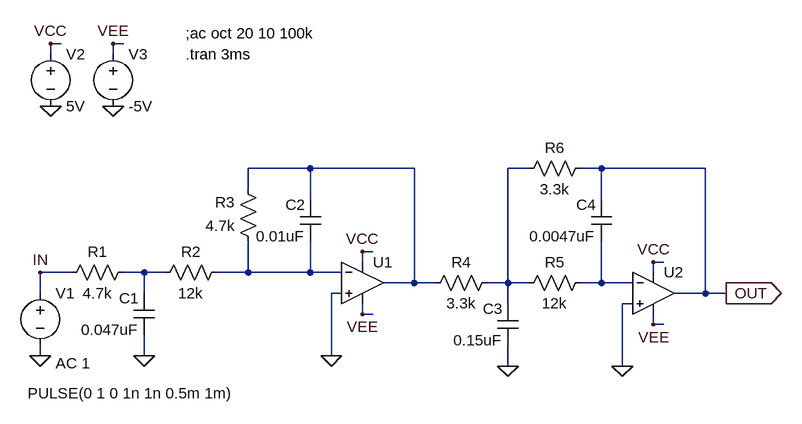
[diagram p0: schematic 4thButterWorthLPF_MFB_fail.asc]
4thButterWorthLPF_MFB_fail.asc, the LTspice schematic file:
Version 4
SHEET 1 964 680
WIRE -336 -176 -352 -176
WIRE -240 -176 -256 -176
WIRE -352 -160 -352 -176
WIRE -256 -160 -256 -176
WIRE 48 16 -48 16
WIRE 208 16 48 16
WIRE 384 16 352 16
WIRE 496 16 464 16
WIRE 656 16 496 16
WIRE -48 48 -48 16
WIRE 48 64 48 16
WIRE 496 64 496 16
WIRE 144 144 128 144
WIRE 128 160 128 144
WIRE 592 160 576 160
WIRE -320 176 -368 176
WIRE -208 176 -240 176
WIRE -176 176 -208 176
WIRE -48 176 -48 128
WIRE -48 176 -96 176
WIRE 48 176 48 128
WIRE 48 176 -48 176
WIRE 96 176 48 176
WIRE 576 176 576 160
WIRE 208 192 208 16
WIRE 208 192 160 192
WIRE 240 192 208 192
WIRE 352 192 352 16
WIRE 352 192 320 192
WIRE 384 192 352 192
WIRE 496 192 496 128
WIRE 496 192 464 192
WIRE 544 192 496 192
WIRE -368 208 -368 176
WIRE -208 208 -208 176
WIRE 96 208 80 208
WIRE 656 208 656 16
WIRE 656 208 608 208
WIRE 688 208 656 208
WIRE 352 224 352 192
WIRE 544 224 528 224
WIRE 128 240 128 224
WIRE 144 240 128 240
WIRE 576 256 576 240
WIRE 592 256 576 256
WIRE -368 304 -368 288
WIRE -208 304 -208 272
WIRE 80 304 80 208
WIRE 352 320 352 288
WIRE 528 320 528 224
FLAG 128 144 VCC
FLAG 128 240 VEE
FLAG -368 304 0
FLAG -352 -80 0
FLAG -256 -80 0
FLAG -352 -176 VCC
FLAG -256 -176 VEE
FLAG 688 208 OUT
IOPIN 688 208 Out
FLAG -208 304 0
FLAG 80 304 0
FLAG 576 160 VCC
FLAG 576 256 VEE
FLAG 352 320 0
FLAG 528 320 0
FLAG -368 176 IN
SYMBOL Opamps\\UniversalOpamp2 128 192 R0
SYMATTR InstName U1
SYMBOL res -224 160 R90
WINDOW 0 0 56 VBottom 2
WINDOW 3 32 56 VTop 2
SYMATTR InstName R1
SYMATTR Value 4.7k
SYMBOL res -80 160 R90
WINDOW 0 0 56 VBottom 2
WINDOW 3 32 56 VTop 2
SYMATTR InstName R2
SYMATTR Value 12k
SYMBOL cap -192 272 R180
WINDOW 0 24 56 Left 2
WINDOW 3 24 8 Left 2
SYMATTR InstName C1
SYMATTR Value 0.047uF
SYMBOL voltage -368 192 R0
WINDOW 123 24 124 Left 2
WINDOW 39 0 0 Left 2
WINDOW 3 -19 170 Left 2
SYMATTR Value2 AC 1
SYMATTR Value PULSE(0 1 0 1n 1n 0.5m 1m)
SYMATTR InstName V1
SYMBOL voltage -352 -176 R0
WINDOW 123 0 0 Left 2
WINDOW 39 0 0 Left 2
SYMATTR InstName V2
SYMATTR Value 5V
SYMBOL voltage -256 -176 R0
WINDOW 123 0 0 Left 2
WINDOW 39 0 0 Left 2
SYMATTR InstName V3
SYMATTR Value -5V
SYMBOL cap 64 128 R180
WINDOW 0 24 56 Left 2
WINDOW 3 24 8 Left 2
SYMATTR InstName C2
SYMATTR Value 0.01uF
SYMBOL res -32 144 R180
WINDOW 0 36 76 Left 2
WINDOW 3 36 40 Left 2
SYMATTR InstName R3
SYMATTR Value 4.7k
SYMBOL Opamps\\UniversalOpamp2 576 208 R0
SYMATTR InstName U2
SYMBOL res 336 176 R90
WINDOW 0 0 56 VBottom 2
WINDOW 3 32 56 VTop 2
SYMATTR InstName R4
SYMATTR Value 3.3k
SYMBOL res 480 176 R90
WINDOW 0 0 56 VBottom 2
WINDOW 3 32 56 VTop 2
SYMATTR InstName R5
SYMATTR Value 12k
SYMBOL cap 368 288 R180
WINDOW 0 24 56 Left 2
WINDOW 3 24 8 Left 2
SYMATTR InstName C3
SYMATTR Value 0.15uF
SYMBOL cap 512 128 R180
WINDOW 0 24 56 Left 2
WINDOW 3 24 8 Left 2
SYMATTR InstName C4
SYMATTR Value 0.0047uF
SYMBOL res 480 0 R90
WINDOW 0 0 56 VBottom 2
WINDOW 3 32 56 VTop 2
SYMATTR InstName R6
SYMATTR Value 3.3k
TEXT -144 -192 Left 2 !;ac oct 20 10 100k
TEXT -144 -160 Left 2 !.tran 3ms

The netlist it stands for:
* 4thButterWorthLPF_MFB_fail.asc
XU1 0 N004 VCC VEE N001 level.2 Avol=1Meg GBW=10Meg Slew=10Meg ilimit=25m rail=0 Vos=0 phimargin=45 en=0 enk=0 in=0 ink=0 Rin=500Meg  ; pins IN+ IN- V+ V- OUT
R1 N003 IN 4.7k
R2 N004 N003 12k
C1 0 N003 0.047uF
V1 IN 0 PULSE(0 1 0 1n 1n 0.5m 1m) AC 1
V2 VCC 0 5V
V3 VEE 0 -5V
C2 N004 N001 0.01uF
R3 N004 N001 4.7k
XU2 0 N005 VCC VEE OUT level.2 Avol=1Meg GBW=10Meg Slew=10Meg ilimit=25m rail=0 Vos=0 phimargin=45 en=0 enk=0 in=0 ink=0 Rin=500Meg  ; pins IN+ IN- V+ V- OUT
R4 N002 N001 3.3k
R5 N005 N002 12k
C3 0 N002 0.15uF
C4 N005 OUT 0.0047uF
R6 OUT N002 3.3k
;ac oct 20 10 100k
.tran 3ms
.lib UniversalOpamps2.sub
.backanno
.end